# EAGLE design MainsLog-Sensor (EAGLE 5.11)
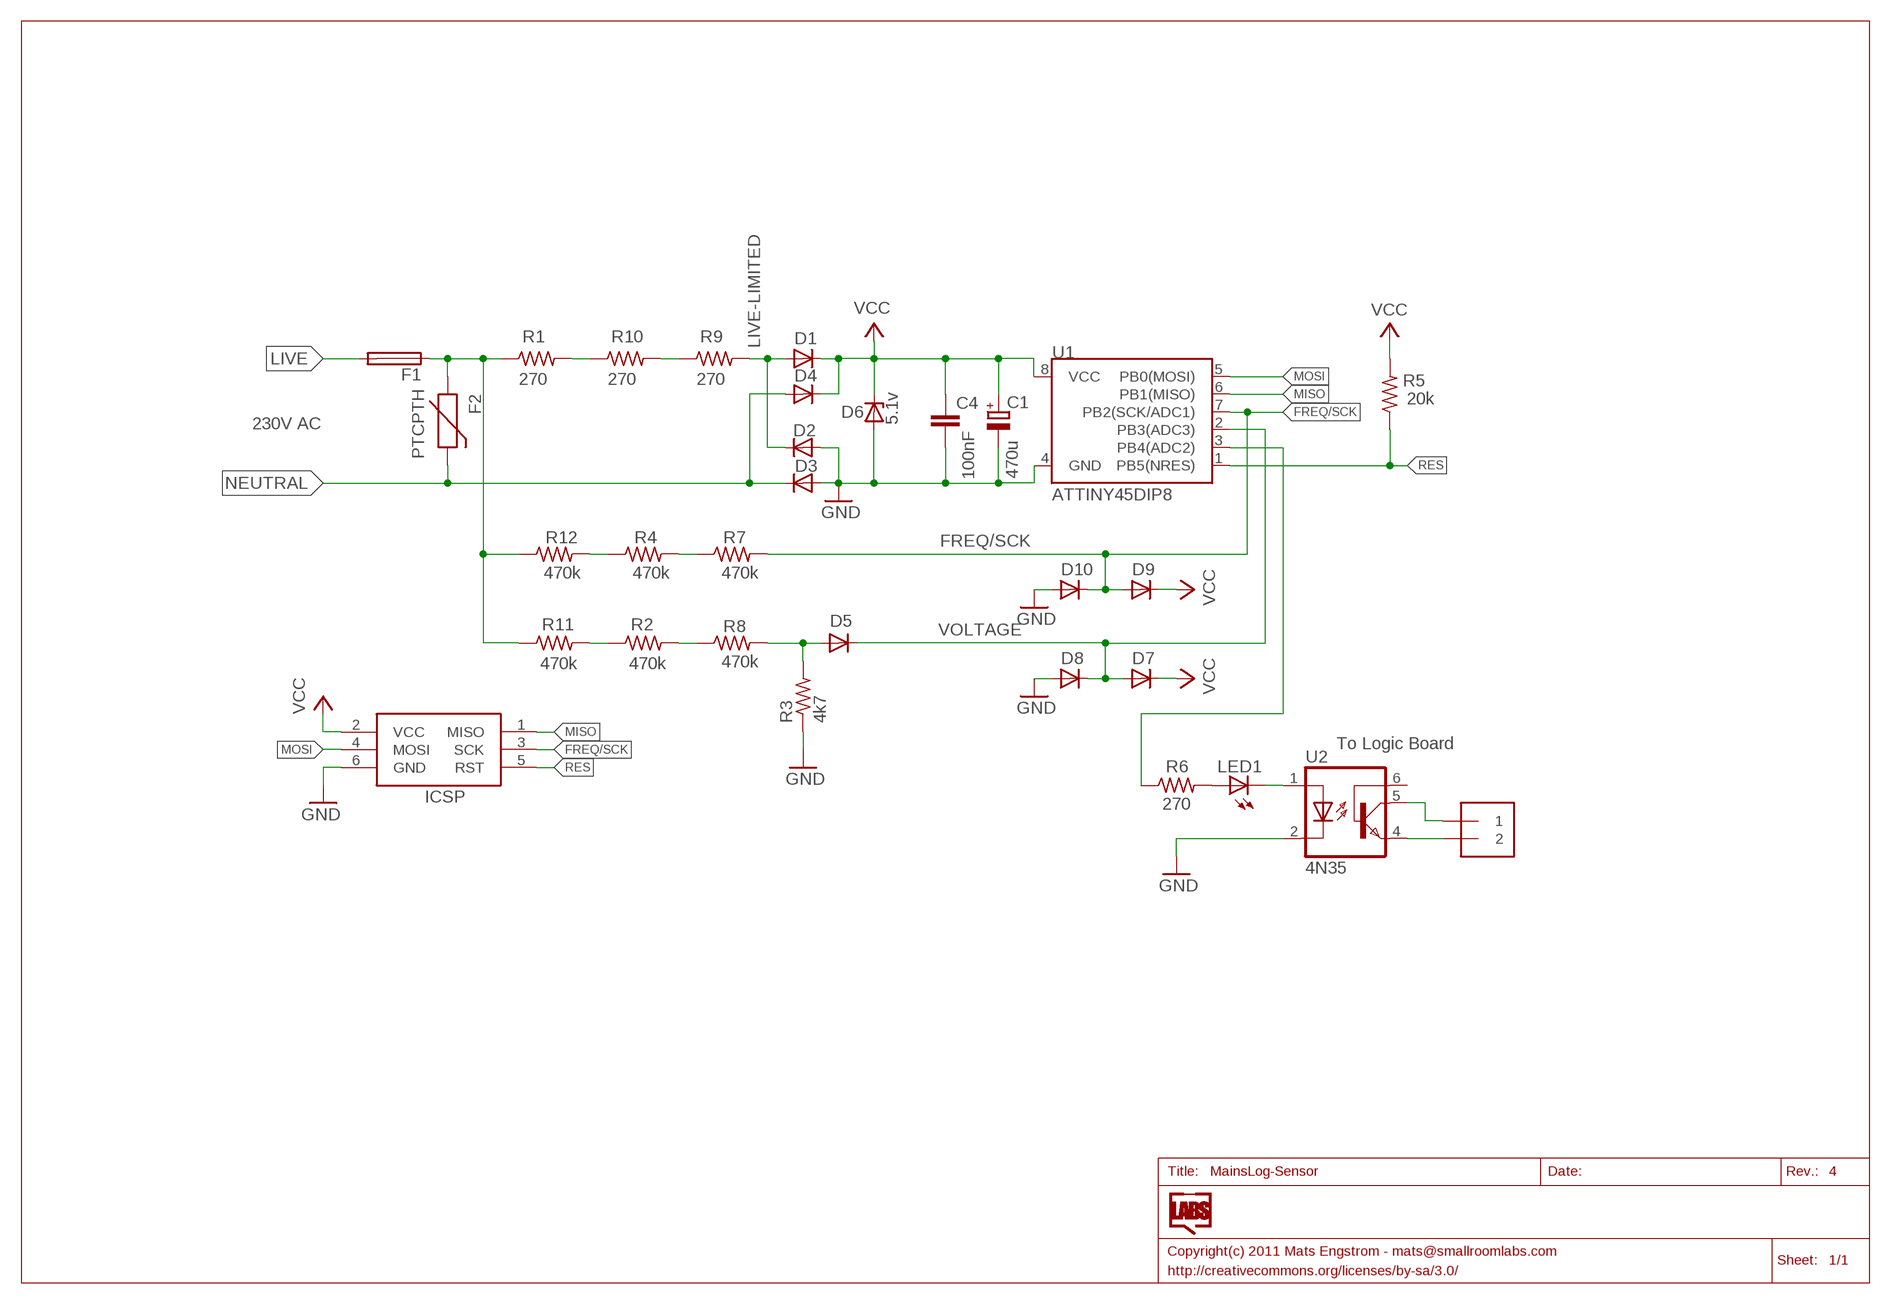
[diagram p0: schematic, sheet 1]

## Parts
C1  470u  CPOL-EUE5-10.5  [E5-10,5]
C4  100nF  C-EU050-025X075  [C050-025X075]
D1  1N4004  [DO41-10]
D2  1N4004  [DO41-10]
D3  1N4004  [DO41-10]
D4  1N4004  [DO41-10]
D5  1N4004  [DO41-10]
D6  5.1v  ZENER-DIODEF126-10  [F126Z10]
D7  1N4004  [DO41-10]
D8  1N4004  [DO41-10]
D9  1N4004  [DO41-10]
D10  1N4004  [DO41-10]
F1  TR5  [TR5]
F2  PTCPTH  [PTC]
ICSP  AVRISP-6  [AVRISP]
J2  1X2-3.5MM  [1X2-3.5MM]
LED1  LED3MM  [LED3MM]
R1  270  R-US_0411/12  [0411/12]
R2  470k  R-US_0204/7  [0204/7]
R3  4k7  R-US_0204/7  [0204/7]
R4  470k  R-US_0204/7  [0204/7]
R5  20k  R-US_0204/7  [0204/7]
R6  270  R-US_0204/7  [0204/7]
R7  470k  R-US_0204/7  [0204/7]
R8  470k  R-US_0204/7  [0204/7]
R9  270  R-US_0411/12  [0411/12]
R10  270  R-US_0411/12  [0411/12]
R11  470k  R-US_0204/7  [0204/7]
R12  470k  R-US_0204/7  [0204/7]
U1  ATTINY45DIP8  [DIP08]
U2  4N35  [DIL06]

## Nets
FREQ/SCK: D9.A D10.C ICSP.3(SCK) R7.2 U1.7(PB2(SCK/ADC1))
GND: C1.- C4.2 D2.A D3.A D6.A D8.A D10.A ICSP.6(GND) R3.1 U1.4(GND) U2.2(C)
LIVE [HV]: F1.2
LIVE-LIMITED [HV]: D1.A D2.C R9.2
MISO: ICSP.1(MISO) U1.6(PB1(MISO))
MOSI: ICSP.4(MOSI) U1.5(PB0(MOSI))
N$1 [HV]: R1.2 R10.1
N$2 [HV]: R2.2 R8.1
N$3: LED1.K(C) U2.1(A)
N$4 [HV]: R4.2 R7.1
N$5 [HV]: R9.1 R10.2
N$6 [HV]: F1.1 F2.P$1 R1.1 R11.1 R12.1
N$8: LED1.A R6.2
N$9: R6.1 U1.3(PB4(ADC2))
N$10: D5.A R3.2 R8.2
N$11 [HV]: R2.1 R11.2
N$12 [HV]: R4.1 R12.2
NEUTRAL [HV]: D3.C D4.A F2.P$2
OUT: J2.1 U2.5(COL)
OUT-GND: J2.2 U2.4(EMI)
RES: ICSP.5(RST) R5.1 U1.1(PB5(NRES))
VCC: C1.+ C4.1 D1.C D4.C D6.C D7.C D9.C ICSP.2(VCC) R5.2 U1.8(VCC)
VOLTAGE: D5.C D7.A D8.C U1.2(PB3(ADC3))
Unconnected: U2.6(BAS)

## Notes on the sheet
- 230V AC
- To Logic Board

## Library data of the parts
C1 = resistor:CPOL-EU: POLARIZED CAPACITOR, European symbol
C4 = rcl:C-EU: CAPACITOR, European symbol
D1-D5 D7-D10 = adafruit:1N4004: DIODE General purpose 1N400x type rectifier (With bigger pads) http://www.ladyada.net/library/pcb/eaglelibrary.html
D6 = diode:ZENER-DIODE: Z-Diode
F1 = fuse:TR5: FUSE Wickmann; OC_FARNELL: unknown; OC_NEWARK: unknown
F2 = SparkFun:PTC: Resettable Fuse PTC Resettable Fuse. Spark Fun Electronics SKU : COM-08357
ICSP = adafruit:AVRISP: AVR ISP HEADER Standard 6 pin header for AVR programming
J2 = adafruit:1X2: 3.5mm Terminal block http://www.ladyada.net/library/pcb/eaglelibrary.html
LED1 = led:LED: LED OSRAM: - CHIPLED LG R971, LG N971, LY N971, LG Q971, LY Q971, LO R971, LY R971 LH N974, LH R974 LS Q976, LO Q976, LY Q976 LO Q996 - Hyper CHIPLED LW Q18S LB Q993, LB Q99A, LB R99A - SideLED LS A670, LO A670, LY A670, LG A670, LP A670 LB A673, LV A673, LT A673, LW A673 LH A674 LY A675 LS A676, LA A676, LO A676, LY A676, LW A676 LS A679, LY A679, LG A679 - Hyper Micro SIDELED® LS Y876, LA Y876, LO Y876, LY Y876 LT Y87S - SmartLED LW L88C, LW L88S LB L89C, LB L89S, LG L890 LS L89K, LO L89K, LY L89K LS L896, LA L896, LO L896, LY L896 - TOPLED LS T670, LO T670, LY T670, LG T670, LP T670 LSG T670, LSP T670, LSY T670, LOP T670, LYG T670 LG T671, LOG T671, LSG T671 LB T673, LV T673, LT T673, LW T673 LH T674 LS T676, LA T676, LO T676, LY T676, LB T676, LH T676, LSB T676, LW T676 LB T67C, LV T67C, LT T67C, LS T67K, LO T67K, LY T67K, LW E67C LS E67B, LA E67B, LO E67B, LY E67B, LB E67C, LV E67C, LT E67C LW T67C LS T679, LY T679, LG T679 LS T770, LO T770, LY T770, LG T770, LP T770 LB T773, LV T773, LT T773, LW T773 LH T774 LS E675, LA E675, LY E675, LS T675 LS T776, LA T776, LO T776, LY T776, LB T776 LHGB T686 LT T68C, LB T68C - Hyper Mini TOPLED® LB M676 - Mini TOPLED Santana® LG M470 LS M47K, LO M47K, LY M47K Source: http://www.osram.convergy.de LUXEON: - LUMILED® LXK2-PW12-R00, LXK2-PW12-S00, LXK2-PW14-U00, LXK2-PW14-V00 LXK2-PM12-R00, LXK2-PM12-S00, LXK2-PM14-U00 LXK2-PE12-Q00, LXK2-PE12-R00, LXK2-PE12-S00, LXK2-PE14-T00, LXK2-PE14-U00 LXK2-PB12-K00, LXK2-PB12-L00, LXK2-PB12-M00, LXK2-PB14-N00, LXK2-PB14-P00, LXK2-PB14-Q00 LXK2-PR12-L00, LXK2-PR12-M00, LXK2-PR14-Q00, LXK2-PR14-R00 LXK2-PD12-Q00, LXK2-PD12-R00, LXK2-PD12-S00 LXK2-PH12-R00, LXK2-PH12-S00 LXK2-PL12-P00, LXK2-PL12-Q00, LXK2-PL12-R00 Source: www.luxeon.com KINGBRIGHT: KA-3528ASYC Source: www.kingbright.com
R1-R12 = rcl:R-US_: RESISTOR, American symbol
U1 = SparkFun:ATTINY45: Atmel ATTiny45
U2 = optocoupler:4N35: MOTOROLA OPTO COUPLER; MF: FAIRCHILD SEMICONDUCTOR; MPN: 4N35; OC_FARNELL: 1328375; OC_NEWARK: 72K9946

## Net classes
0 default: width 0.305 mm, drill 0.305 mm, clearance 0.5 mm
1 HV: width 0.305 mm, drill 0.305 mm, clearance 2 mm

## Board
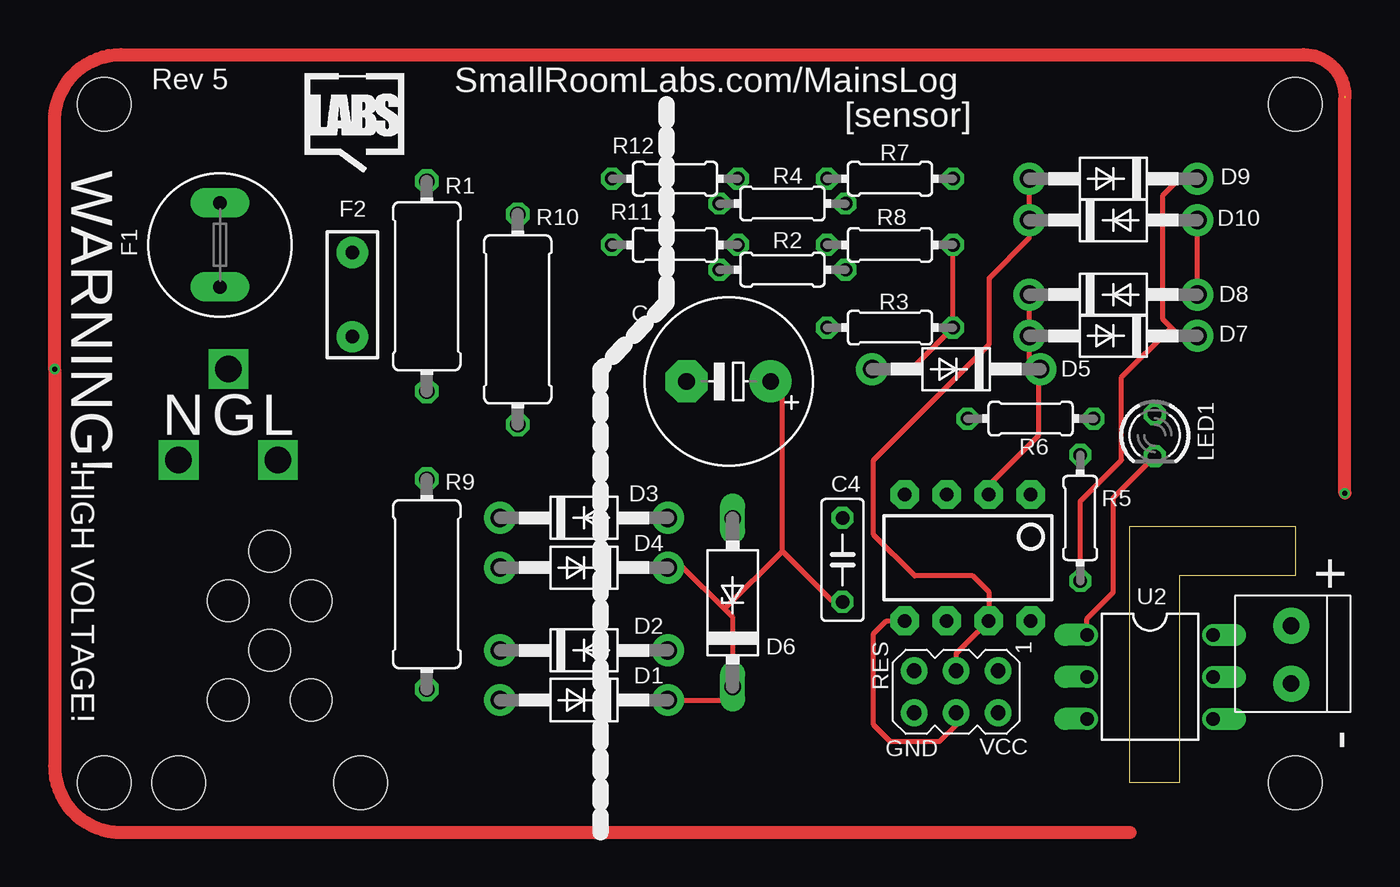
[diagram p1: board, top side]
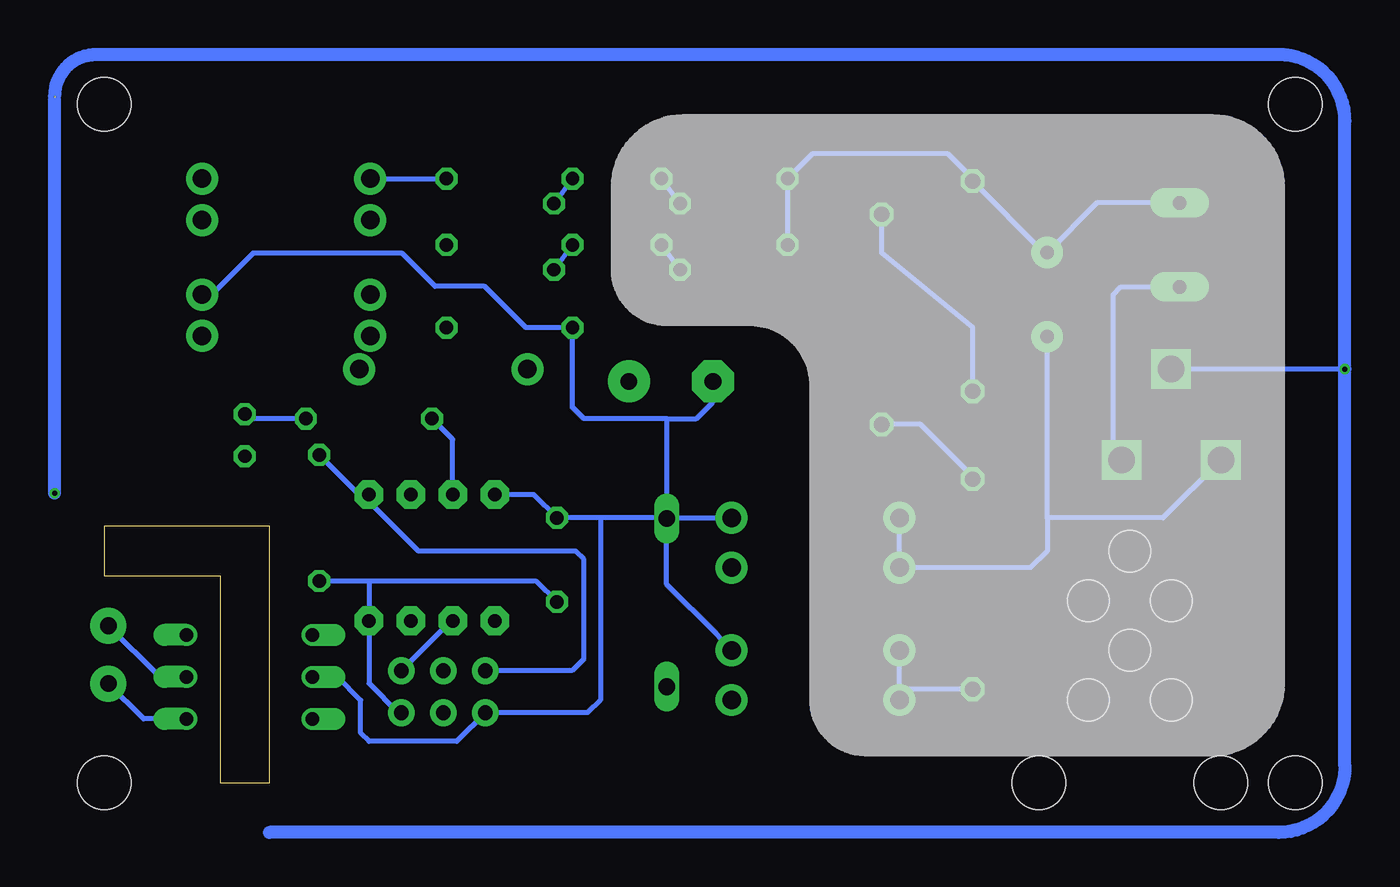
[diagram p2: board, bottom side, seen from below]

No outline drawn. Coordinates in mm, seen from the top.
Copper layers (1*16): Top 0.035mm / dielectric 1.5mm / Bottom 0.035mm
Design rules "Fusion_eagle_rule_v1.1": minimum track width 6mil, minimum drill 12mil, track to track 6mil, track to pad 6mil, pad to pad 6mil, via to via 6mil, smd to smd 0mil, copper to edge 10mil, drill to drill 10mil, minimum pad ring 10mil, minimum via ring 6mil, stop-mask expansion 2mil, vias tented up to drill 100mil, thermal gap 10mil
Holes 2.5 mm at 11.5,9 11.5,15 16.5,9 16.5,15 14,12 14,18
Holes 3.2 mm at 8.5,4 19.5,4 4,45 4,4 76,4 76,45
Milling: 6 lines

### Footprints (pad centres in the part's own frame; a part is rotated, then mirrored left to right if it is on the bottom)
E5-10,5 = drill 1.016 pad 2.54 round: + -2.54,0 | drill 1.016 pad 2.54 octagon: - 2.54,0
C050-025X075 = drill 0.813 octagon: 1 -2.54,0; 2 2.54,0
DO41-10 = drill 1.118 pad 1.93 round: A 5.08,0; C -5.08,0
F126Z10 = drill 1.016 long: A 5.08,0; C -5.08,0
TR5 = drill 0.813 pad 1.778 long: 1 -2.54,0; 2 2.54,0
PTC = drill 0.8 pad 1.88 round: P$1 -2.54,0; P$2 2.54,0
AVRISP = drill 0.9 pad 1.626 round: 1 -1.27,2.54; 2 1.27,2.54; 3 -1.27,0; 4 1.27,0; 5 -1.27,-2.54; 6 1.27,-2.54
1X2-3.5MM = drill 1 pad 2.184 round: 1 1.8,0; 2 -1.7,0
LED3MM = drill 0.813 octagon: A -1.27,0; K 1.27,0
0411/12 = drill 0.914 octagon: 1 -6.35,0; 2 6.35,0
0204/7 = drill 0.813 octagon: 1 -3.81,0; 2 3.81,0
DIP08 = drill 0.813 pad 1.727 octagon: 1 -3.81,-3.81; 2 -1.27,-3.81; 3 1.27,-3.81; 4 3.81,-3.81; 5 3.81,3.81; 6 1.27,3.81; 7 -1.27,3.81; 8 -3.81,3.81
DIL06 = drill 0.813 offset: 1 -2.54,-3.81; 2 0,-3.81; 3 2.54,-3.81; 4 2.54,3.81; 5 0,3.81; 6 -2.54,3.81

### Placement (x,y rotation side)
C1  41.75,28.25 180 top
C4  48.63,17.47 90 top
D1  33,9 180 top
D2  33,12 0 top
D3  33,20 0 top
D4  33,17 180 top
D5  55.5,29 180 top
D6  41.99,14.89 90 top
D7  65,31 180 top
D8  65,33.5 0 top
D9  65,40.5 180 top
D10  65,38 0 top
F1  11,36.5 270 top
F2  19,33.5 270 top
ICSP  55.5,9.5 270 top
J2  75.75,11.69 90 top
LED1  67.5,25 270 top
R1  23.5,34 270 top
R2  45,35 0 top
R3  51.5,31.5 0 top
R4  45,39 0 top
R5  63,20 270 top
R6  60,26 0 top
R7  51.5,40.5 0 top
R8  51.5,36.5 0 top
R9  23.5,16 270 top
R10  29,32 270 top
R11  38.5,36.5 0 top
R12  38.5,40.5 0 top
U1  56.2,17.6 180 top
U2  67.21,10.4 270 top
U$2  [SRL-LOGO-SILK-5MM]  16.07,41.93 0 top

### Tracks (layer width: path | path; a pad name or v marks a point on that pad's centre or on a via)
EARTH  (via drill 0.3, 1.6)  (1 unrouted)
  Top 0.8: 66,1 5,1 arc-90 1,5 v1,29 1,44 arc-90 5,48 76.5,48 arc-90 79,45.5 | v79,21.5 79,45.4
  Bottom 0.305: v1,29 v11.5,29
  Bottom 0.8: 66,1 5,1 arc-90 1,5 v1,29 1,44 arc-90 5,48 76.5,48 arc-90 79,45.5 | v79,21.5 79,45.3
FREQ/SCK
  Top 0.305: D9.A D10.C 59.92,36.92 57.5,34.5 57.5,30.5 50.5,23.5 50.5,19 53,16.5 56.5,16.5 57.5,15.5 57.5,13.81 U1.7 55.5,11.81 ICSP.3
  Bottom 0.305: D9.A R7.2
GND
  Top 0.305: D8.A D10.A
  Bottom 0.305: U1.4 50.03,21.41 C4.2 46,20 | 46,20 42.02,20 D6.A | D2.A 39,13 42,16 D6.A | D3.A 41.96,20 D6.A | U2.2 61.9,10.4 60.5,9 60.5,7 60,6.5 54.69,6.5 ICSP.6 46.77,8.23 46,9 46,20 | D8.A 69.5,33.5 67,36 58,36 56,34 53,34 50.5,31.5 R3.1 47.69,26.69 47,26 42,26 | 42,26 40.21,26 39.21,27 C1.- | D6.A 41.99,25.99 42,26
LIVE  (via drill 1.6)
  Bottom 0.305: F1.2 14.54,33.96 15,33.5 15,24 v14.5,23.5
LIVE-LIMITED
  Bottom 0.305: D2.C D1.A 27.57,9.65 R9.2
MISO
  Bottom 0.305: U1.6 55.02,13.79 ICSP.1
MOSI
  Top 0.305: U1.5 51.29,13.79 50.5,13 50.5,7.5 51.5,6.5 54.5,6.5 55.5,7.5 ICSP.4
N$1
  Bottom 0.305: R10.1 29,36 23.5,31.5 R1.2
N$2
  Bottom 0.305: R8.1 R2.2
N$3
  Top 0.305: U2.1 63.4,13.9 65,15.5 65,21.23 LED1.K
N$4
  Bottom 0.305: R7.1 R4.2
N$5
  Bottom 0.305: R9.1 23.5,22.5 26.65,25.65 R10.2
N$6
  Bottom 0.305: F2.P$1 18.96,36 | F2.P$1 19.19,36.04 R1.1 23.5,40.5 25,42 33.19,42 R12.1 R11.1 | F1.1 16,39.04 F2.P$1
N$8
  Bottom 0.305: R6.2 67.23,26 LED1.A
N$9
  Bottom 0.305: U1.3 54.93,24.74 R6.1
N$10
  Top 0.305: R8.2 R3.2 52.81,29 D5.A
N$11
  Bottom 0.305: R2.1 R11.2
N$12
  Bottom 0.305: R4.1 R12.2
NEUTRAL  (via drill 1.6)
  Bottom 0.305: D3.C D4.A 20,17 19,18 19,20 | 19,20 F2.P$2 | 19,20 12,20 v8.5,23.5
OUT
  Bottom 0.305: U2.5 72.66,10.4 J2.1
OUT-GND
  Bottom 0.305: U2.4 73.62,7.86 J2.2
RES
  Bottom 0.305: ICSP.5 47.73,10.77 47,11.5 47,17.5 47.5,18 57,18 60.01,21.01 U1.1 60.6,21.41 R5.1
VCC
  Top 0.305: D1.C 41.8,9 D6.C 42,14 41.5,14.5 | D4.C 39,17 41.5,14.5 | 45,18 45,27.53 C1.+ | D9.C 69,40.5 68,39.5 68,32 68.5,31.5 | 68.5,31.5 69,31 D7.C | 41.5,14.5 45,18 | 45,18 48,15 48.56,15 C4.1 | R5.2 63,21 65.5,23.5 65.5,28.5 68.5,31.5
  Bottom 0.305: ICSP.2 58.23,8.23 60,10 60,13.77 U1.8 60,16.19 | 60,16.19 49.9,16.19 C4.1 | 60,16.19 R5.2
VOLTAGE
  Top 0.305: D8.C D7.A 59.92,29.66 D5.C 60.5,28.92 60.5,25 57.47,21.97 U1.2

### Text on the board
tPlace: Rev 5 | SmallRoomLabs.com/MainsLog | [sensor] | WARNING! | N | G | L | HIGH VOLTAGE! | + | RES | GND | VCC | -